# EAGLE design Schema (EAGLE 6.5.0)
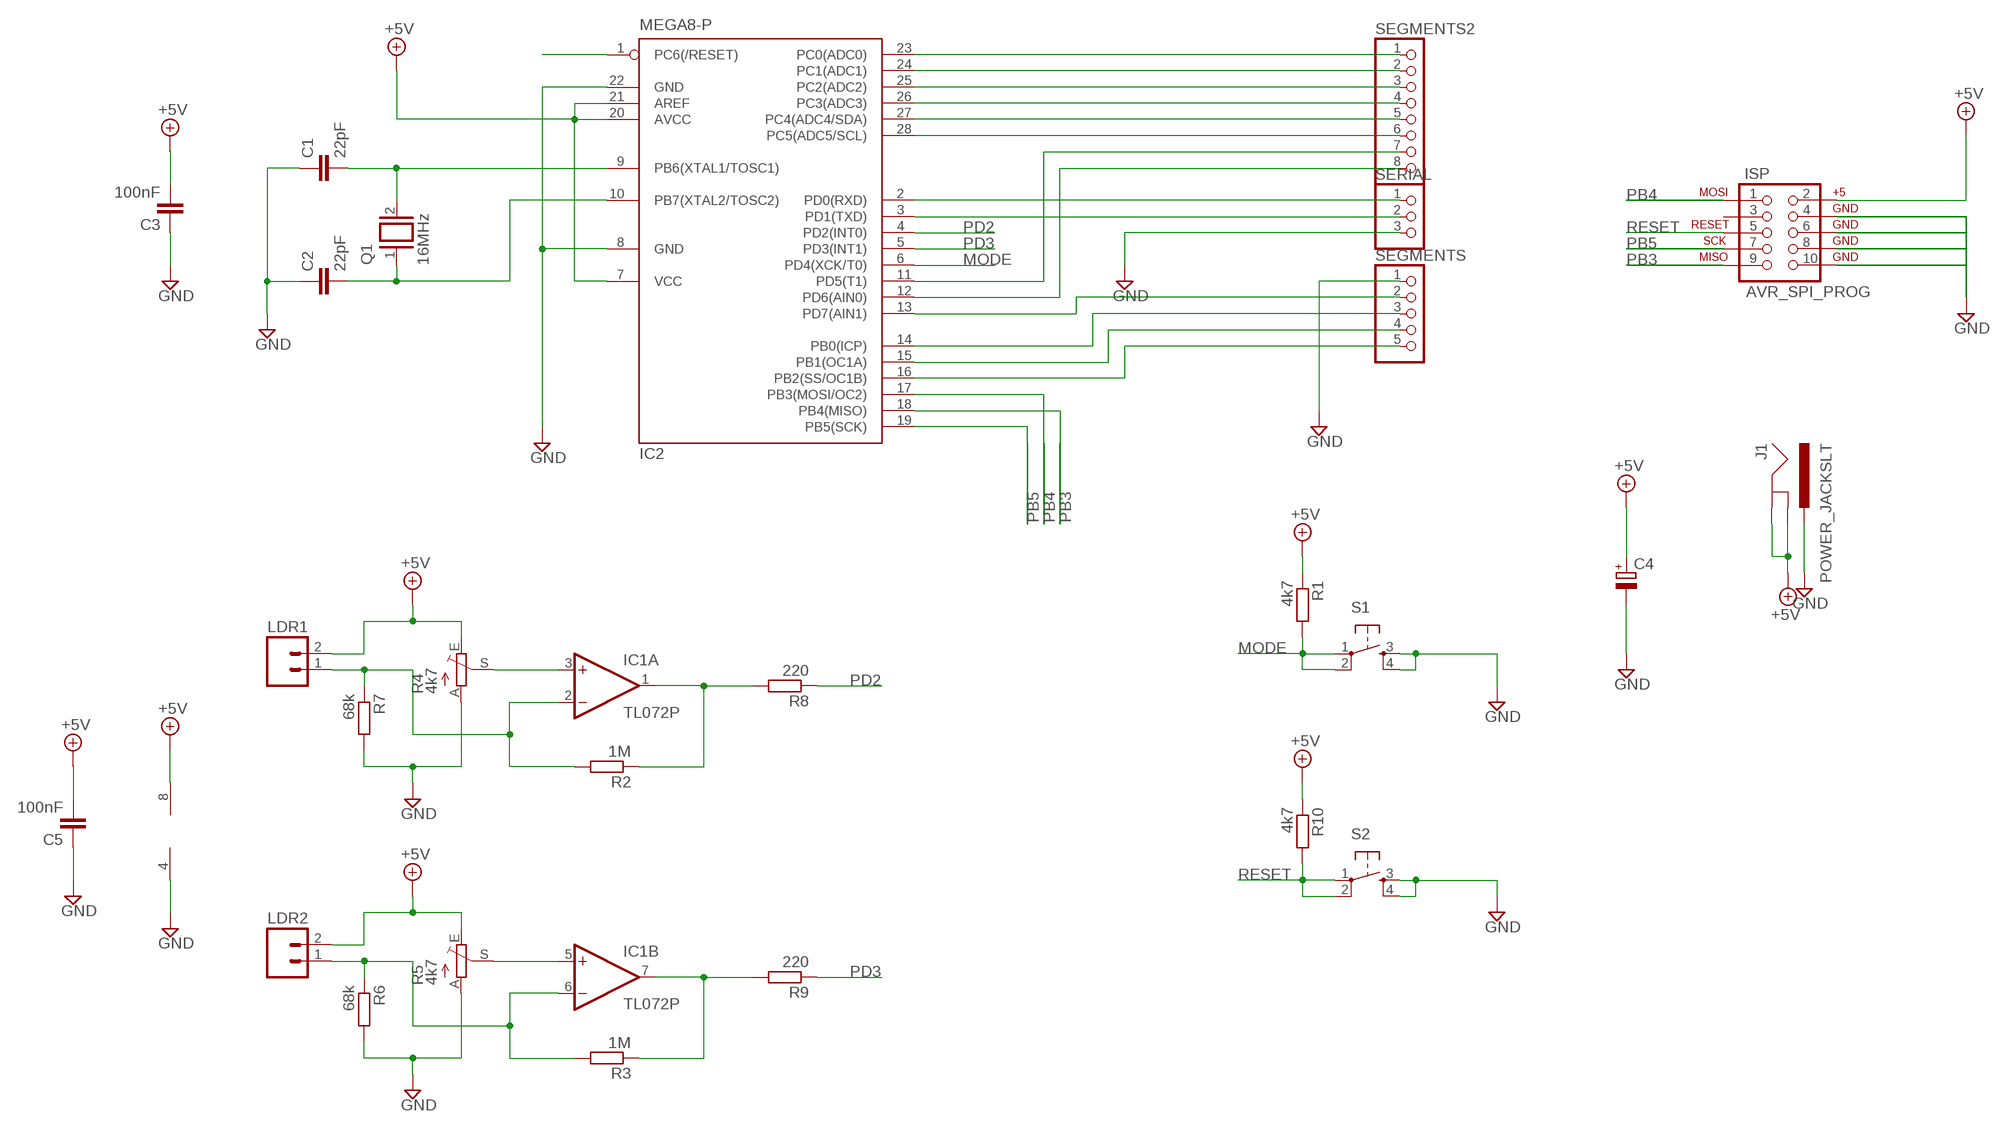
[diagram p0: schematic, sheet 1]

## Parts
C1  22pF  C-EU025-024X044  [C025-024X044]
C2  22pF  C-EU025-024X044  [C025-024X044]
C3  100nF  C-EU025-024X044  [C025-024X044]
C4  CPOL-EUTT2D5  [TT2D5]
C5  100nF  C-EU025-024X044  [C025-024X044]
IC1  TL072P  [DIL08]
IC2  MEGA8-P  [DIL28-3]
ISP  AVR_SPI_PROG  [AVR_ICSP]
J1  POWER_JACKSLT  [POWER_JACK_SLOT]
LDR1  M02LOCK  [1X02_LOCK]
LDR2  M02LOCK  [1X02_LOCK]
Q1  16MHz  XTAL/S  [QS]
R1  4k7  R-EU_0204/7  [0204/7]
R2  1M  R-EU_0204/7  [0204/7]
R3  1M  R-EU_0204/7  [0204/7]
R4  4k7  TRIM_EU-LI10  [LI10]
R5  4k7  TRIM_EU-LI10  [LI10]
R6  68k  R-EU_0204/7  [0204/7]
R7  68k  R-EU_0204/7  [0204/7]
R8  220  R-EU_0204/7  [0204/7]
R9  220  R-EU_0204/7  [0204/7]
R10  4k7  R-EU_0204/7  [0204/7]
S1  TAC_SWITCHPTH  [TACTILE-PTH]
S2  TAC_SWITCHPTH  [TACTILE-PTH]
SEGMENTS  PINHD-1X5  [1X05]
SEGMENTS2  PINHD-1X8  [1X08]
SERIAL  PINHD-1X3  [1X03]

## Nets
+5V: C3.2 C4.+ C5.2 IC1.8(P:V+) IC2.7(VCC) IC2.20(AVCC) IC2.21(AREF) ISP.2 J1.GND@1(GNDBREAK) J1.GND@2(GND) LDR1.2 LDR2.2 R1.1 R4.E R5.E R10.1
GND: C1.1 C2.1 C3.1 C4.- C5.1 IC1.4(P:V-) IC2.8(GND) IC2.22(GND) ISP.4 ISP.6 ISP.8 ISP.10 J1.PWR R4.A R5.A R6.2 R7.2 S1.3 S1.4 S2.3 S2.4 SEGMENTS.1 SERIAL.3
MODE: IC2.6(PD4(XCK/T0)) R1.2 S1.1 S1.2
N$1: C1.2 IC2.9(PB6(XTAL1/TOSC1)) Q1.2
N$2: C2.2 IC2.10(PB7(XTAL2/TOSC2)) Q1.1
N$3: IC1.1(A:OUT) R2.1 R8.2
N$4: IC2.3(PD1(TXD)) SERIAL.2
N$5: IC2.2(PD0(RXD)) SERIAL.1
N$6: IC1.7(B:OUT) R3.1 R9.2
N$7: IC1.3(A:+IN) R4.S
N$8: IC1.5(B:+IN) R5.S
N$9: IC1.6(B:-IN) LDR2.1 R3.2 R6.1
N$10: IC1.2(A:-IN) LDR1.1 R2.2 R7.1
N$11: IC2.16(PB2(SS/OC1B)) SEGMENTS.5
N$12: IC2.15(PB1(OC1A)) SEGMENTS.4
N$13: IC2.14(PB0(ICP)) SEGMENTS.3
N$15: IC2.24(PC1(ADC1)) SEGMENTS2.2
N$16: IC2.25(PC2(ADC2)) SEGMENTS2.3
N$17: IC2.26(PC3(ADC3)) SEGMENTS2.4
N$18: IC2.27(PC4(ADC4/SDA)) SEGMENTS2.5
N$19: IC2.28(PC5(ADC5/SCL)) SEGMENTS2.6
N$20: IC2.12(PD6(AIN0)) SEGMENTS2.8
N$21: IC2.11(PD5(T1)) SEGMENTS2.7
N$22: IC2.13(PD7(AIN1)) SEGMENTS.2
PB3: IC2.18(PB4(MISO)) ISP.9
PB4: IC2.17(PB3(MOSI/OC2)) ISP.1
PB5: IC2.19(PB5(SCK)) ISP.7
PD2: IC2.4(PD2(INT0)) R8.1
PD3: IC2.5(PD3(INT1)) R9.1
RESET: IC2.1(PC6(/RESET)) ISP.5 R10.2 S2.1 S2.2
SEGMENTS: IC2.23(PC0(ADC0)) SEGMENTS2.1
Unconnected: ISP.3

## Library data of the parts
C1-C3 C5 = rcl:C-EU: CAPACITOR, European symbol
C4 = rcl:CPOL-EU: POLARIZED CAPACITOR, European symbol
IC1 = linear:TL072: OP AMP
IC2 = atmel:MEGA8-P: MICROCONTROLLER 8 Kbytes FLASH, 1 kbytes SRAM, 512 bytes EEPROM, USART, 4-channel 10 bit ADC, 2-channel 8 bit ADC Pin compatible with Atmega48, ATMega88, ATMega168 Source: avr.lbr; OC_FARNELL: unknown; OC_NEWARK: unknown
ISP = SparkFun:AVR_SPI_PROG: AVR ICSP Header This is the standard AVR In Circuit Serial Programming header. Minimal, but includes pin one indicator. Works with standard Olimex programmers. Also look for the 6-pin reduced version. Spark Fun Electronics SKU: PRT-00778
J1 = SparkFun:POWER_JACK: Power Jack This is the standard 5.5mm barrel jack for power. The PTH is the most common, proven, reliable, footprint. All others are experimental. The Slot footprint only works if the mill layer is transmitted to the PCB fab house so be warned. Spark Fun Electronics SKU : PRT-00119. Mating wall wart : TOL-00298 (and others)
LDR1 LDR2 = SparkFun:M02: Header 2 Standard 2-pin 0.1" header. Use with straight break away headers (SKU : PRT-00116), right angle break away headers (PRT-00553), swiss pins (PRT-00743), machine pins (PRT-00117), and female headers (PRT-00115). Molex polarized connector foot print use with SKU : PRT-08233 with associated crimp pins and housings.
Q1 = special:XTAL/S: CRYSTAL
R1-R3 R6-R10 = rcl:R-EU_: RESISTOR, European symbol
R4 R5 = pot:TRIM_EU-: POTENTIOMETER
S1 S2 = SparkFun:TAC_SWITCH: Momentary Switch Button commonly used for reset or general input. Spark Fun Electronics SKU : COM-00097
SEGMENTS = pinhead:PINHD-1X5: PIN HEADER
SEGMENTS2 = pinhead:PINHD-1X8: PIN HEADER
SERIAL = pinhead:PINHD-1X3: PIN HEADER

## Board
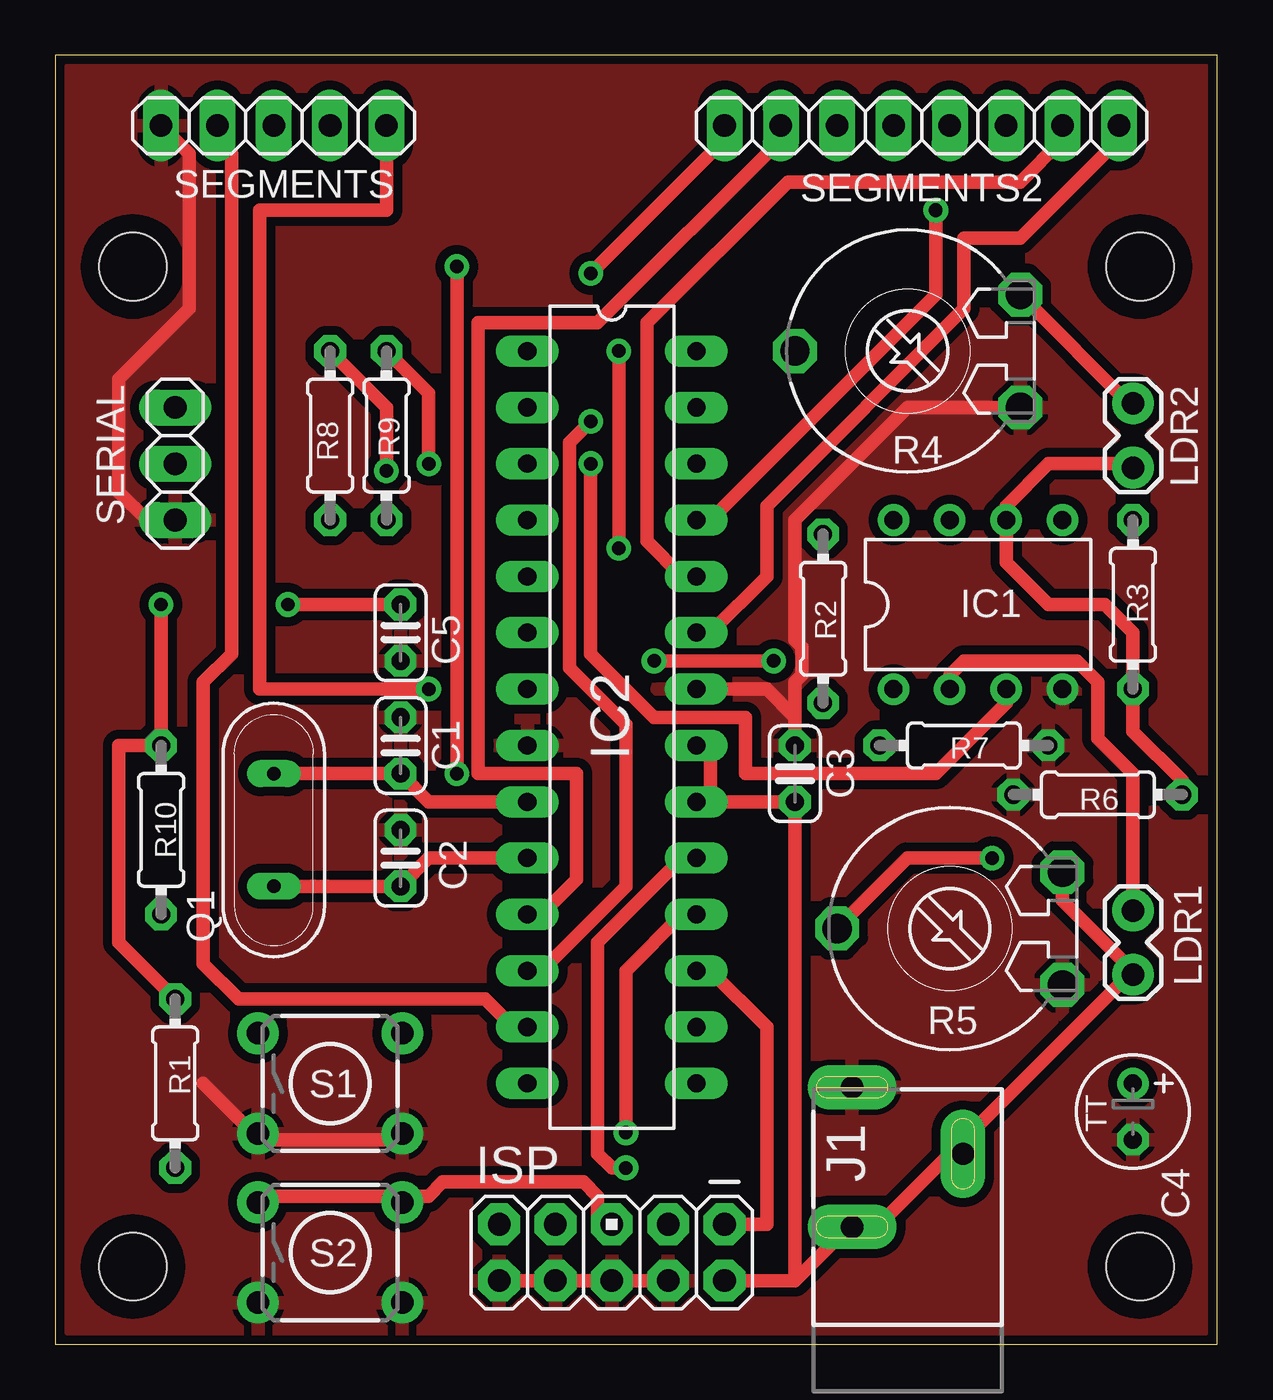
[diagram p1: board, top side]
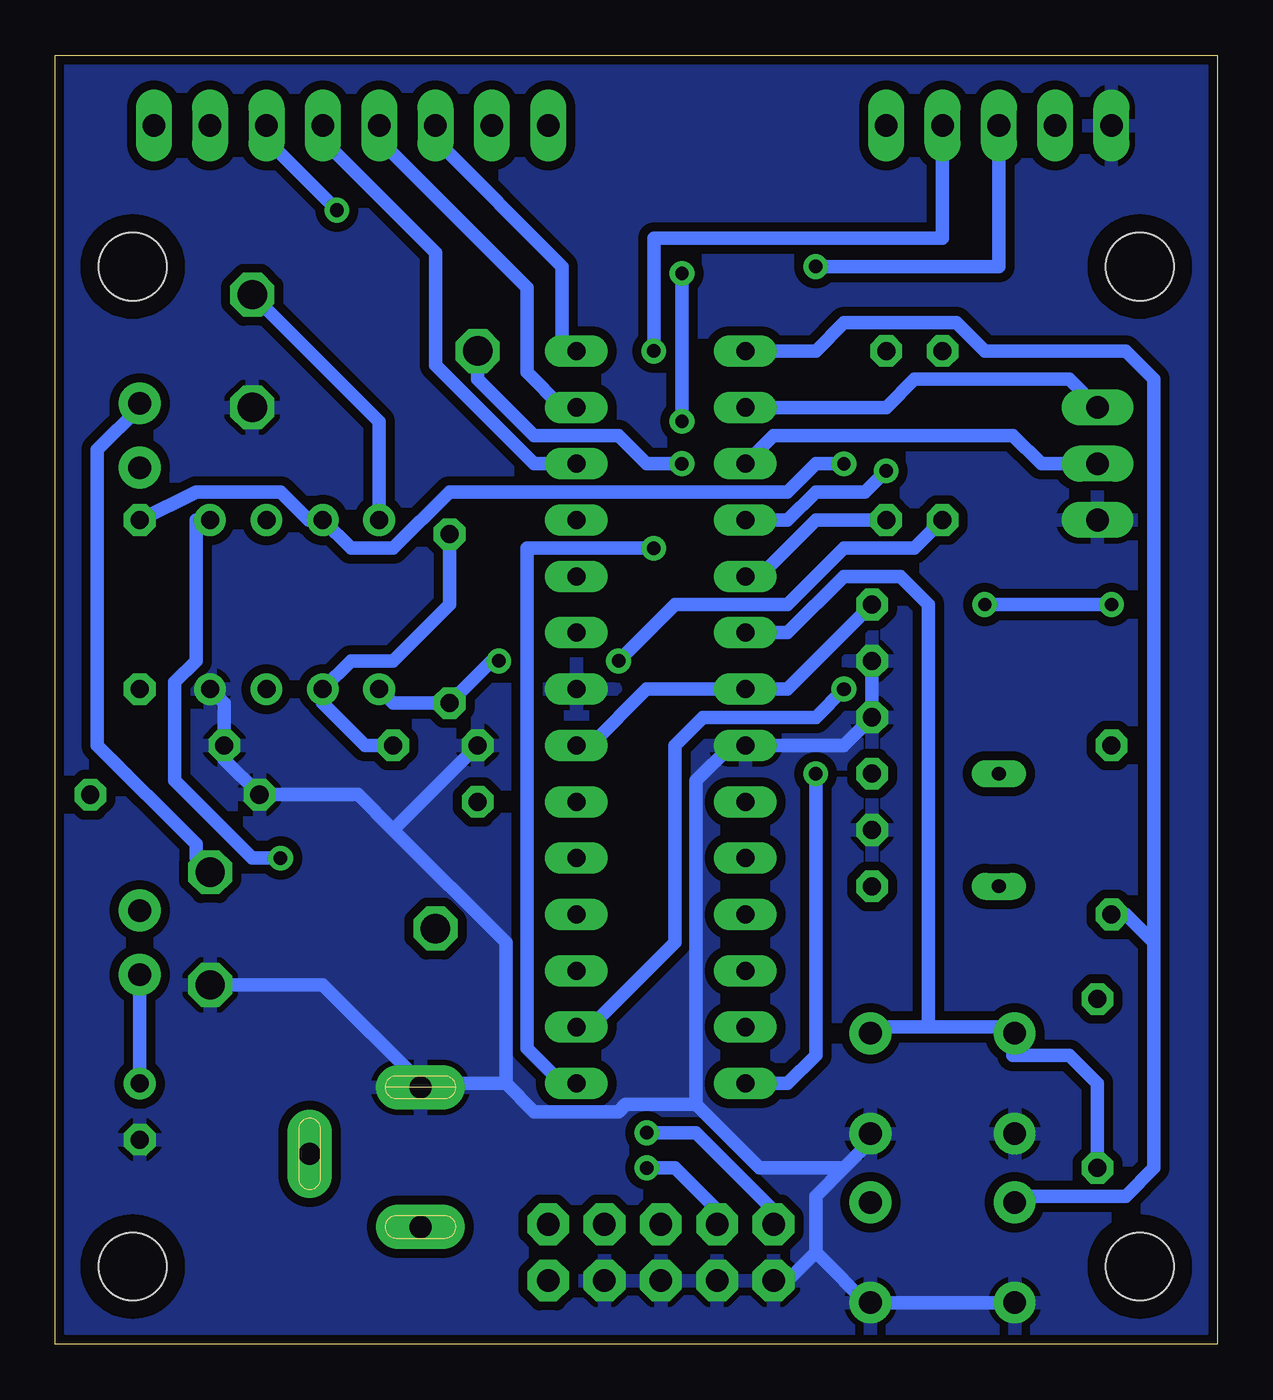
[diagram p2: board, bottom side, seen from below]

Size 52.38 x 58.09 mm. Coordinates in mm from the lower left corner, seen from the top.
Outline: 0,0 52.38,0 52.38,58.09 0,58.09 0,0
Copper layers (1*16): Top 0.035mm / dielectric 1.5mm / Bottom 0.035mm
Design rules "default": minimum track width 8mil, minimum drill 20mil, track to track 8mil, track to pad 8mil, pad to pad 8mil, via to via 8mil, smd to smd 8mil, copper to edge 10mil, drill to drill 8mil, minimum pad ring 12mil, minimum via ring 10mil, stop-mask expansion 4mil, vias tented up to drill 25mil, thermal gap 10mil

### Footprints (pad centres in the part's own frame; a part is rotated, then mirrored left to right if it is on the bottom)
C025-024X044 = drill 0.813 octagon: 1 -1.27,0; 2 1.27,0
TT2D5 = drill 0.813: + -1.27,0 | drill 0.813 octagon: - 1.27,0
DIL08 = drill 0.813 pad 1.27: 1 -3.81,-3.81; 2 -1.27,-3.81; 3 1.27,-3.81; 4 3.81,-3.81; 5 3.81,3.81; 6 1.27,3.81; 7 -1.27,3.81; 8 -3.81,3.81
DIL28-3 = drill 0.813 long: 1 -16.51,-3.81; 2 -13.97,-3.81; 3 -11.43,-3.81; 4 -8.89,-3.81; 5 -6.35,-3.81; 6 -3.81,-3.81; 7 -1.27,-3.81; 8 1.27,-3.81; 9 3.81,-3.81; 10 6.35,-3.81; 11 8.89,-3.81; 12 11.43,-3.81; 13 13.97,-3.81; 14 16.51,-3.81; 15 16.51,3.81; 16 13.97,3.81; 17 11.43,3.81; 18 8.89,3.81; 19 6.35,3.81; 20 3.81,3.81; 21 1.27,3.81; 22 -1.27,3.81; 23 -3.81,3.81; 24 -6.35,3.81; 25 -8.89,3.81; 26 -11.43,3.81; 27 -13.97,3.81; 28 -16.51,3.81
AVR_ICSP = drill 1.016 pad 1.88 octagon: 1 -1.27,5.08; 2 1.27,5.08; 3 -1.27,2.54; 4 1.27,2.54; 5 -1.27,0; 6 1.27,0; 7 -1.27,-2.54; 8 1.27,-2.54; 9 -1.27,-5.08; 10 1.27,-5.08
POWER_JACK_SLOT = drill 1 pad 2 long: GND@1 2.58,7.5; GND@2 7.58,10.8; PWR 2.58,13.8
1X02_LOCK = drill 1.016 pad 1.88: 1 -0.178,0; 2 2.718,0
QS = drill 0.61 long: 1 -2.54,0; 2 2.54,0
0204/7 = drill 0.813 octagon: 1 -3.81,0; 2 3.81,0
LI10 = drill 1.321 octagon: A -2.54,-5.08; E 2.54,-5.08; S 0,5.08
TACTILE-PTH = drill 1.016 pad 1.88: 1 -3.251,2.261; 2 3.251,2.261; 3 -3.251,-2.261; 4 3.251,-2.261
1X05 = drill 1.016 long: 1 -5.08,0; 2 -2.54,0; 3 0,0; 4 2.54,0; 5 5.08,0
1X08 = drill 1.016 long: 1 -8.89,0; 2 -6.35,0; 3 -3.81,0; 4 -1.27,0; 5 1.27,0; 6 3.81,0; 7 6.35,0; 8 8.89,0
1X03 = drill 1.016 long: 1 -2.54,0; 2 0,0; 3 2.54,0
STAND-OFF-TIGHT = hole 3.048: 0,0

### Placement (x,y rotation side)
C1  15.56,26.99 270 top
C2  15.56,21.91 270 top
C3  33.34,25.72 270 top
C4  48.58,10.48 270 top
C5  15.56,32.07 90 top
IC1  41.59,33.34 0 top
IC2  25.08,28.26 270 top
ISP  25.08,4.13 270 top
J1  33.34,-2.22 0 top
LDR1  48.58,19.37 270 top
LDR2  48.58,39.69 90 top
Q1  9.84,23.18 90 top
R1  5.4,11.75 270 top
R2  34.61,32.7 90 top
R3  48.58,33.34 270 top
R4  38.42,44.77 90 top
R5  40.32,18.73 90 top
R6  46.99,24.77 180 top
R7  40.96,26.99 0 top
R8  12.38,40.96 270 top
R9  14.92,40.96 90 top
R10  4.76,23.18 270 top
S1  12.38,11.75 0 top
S2  12.38,4.13 0 top
SEGMENTS  9.84,54.93 0 top
SEGMENTS2  39.05,54.93 180 top
SERIAL  5.4,39.69 270 top
U$2  [STAND-OFF-TIGHT]  3.49,3.49 0 top
U$3  [STAND-OFF-TIGHT]  3.49,48.58 0 top
U$4  [STAND-OFF-TIGHT]  48.89,48.58 0 top
U$5  [STAND-OFF-TIGHT]  48.89,3.49 0 top

### Tracks (layer width: path | path; a pad name or v marks a point on that pad's centre or on a via)
+5V  (via drill 0.6)
  Top 0.61: R4.E 48.58,42.23 LDR2.2 | 48.58,16.83 45.4,20 R5.E | 48.58,16.83 40.96,9.21 | 48.58,16.83 LDR1.2 | R1.1 2.86,18.1 2.86,26.99 4.13,26.99 | 29.53,24.45 29.53,26.99 IC2.21 | 29.53,24.45 C3.2 33.34,2.86 | 29.53,24.45 IC2.20 | 33.34,2.86 ISP.2 | 33.34,2.86 35.88,5.4 J1.GND@1 37.15,5.4 40.96,9.21 | 40.96,9.21 J1.GND@2 | R10.1 4.13,26.99 | C5.2 v10.48,33.34 | v4.76,33.34 4.76,27.62 4.13,26.99
  Bottom 0.61: IC1.8 37.78,41.59 R4.E | LDR2.2 48.58,42.23 50.48,40.32 50.48,26.99 46.04,22.54 46.04,21.91 R5.E | C5.2 19.37,29.53 IC2.7 25.72,29.53 28.26,26.99 IC2.21 | C4.+ LDR1.2 | v10.48,33.34 v4.76,33.34
GND
  Top 0.61: IC2.22 32.07,29.53 33.34,28.26 | C3.1 33.34,28.26 | R4.A 38.42,42.23 33.34,37.15 33.34,31.75 33.66,31.43 33.66,30.16 33.34,29.84 33.34,28.26 | SEGMENTS.1 6.03,53.66 6.03,46.67 2.86,43.5 2.86,38.42 4.13,37.15 SERIAL.3 | 9.21,9.21 15.56,9.21 S1.4 | ISP.10 ISP.8 ISP.6 ISP.4 | 9.21,9.21 6.67,11.75 | 9.21,9.21 S1.3
  Bottom 0.61: 37.15,11.75 J1.PWR | 16.83,7.94 18.1,6.67 18.1,4.13 | 16.83,7.94 15.56,9.21 S1.4 | 18.1,4.13 19.37,2.86 ISP.10 | 23.49,10.79 23.49,25.4 21.91,26.99 IC2.8 16.83,26.99 C1.1 C5.1 | 23.49,10.79 20.64,7.94 16.83,7.94 | 32.07,11.75 32.07,18.1 37.15,23.18 | 32.07,11.75 30.8,10.48 26.99,10.48 26.67,10.79 23.49,10.79 | S2.3 15.28,1.87 15.56,1.59 18.1,4.13 | 37.15,23.18 38.74,24.77 R6.2 44.77,26.35 R7.2 44.77,28.89 IC1.4 | R5.A 40.32,16.19 35.88,11.75 32.07,11.75 | C3.1 37.15,23.18
  pour Top (isolate 0.406): 0.63,57.47 0.63,0.64 51.75,0.64 51.75,57.47
  pour Bottom (isolate 0.406): 0.63,0.64 51.75,0.64 51.75,57.47 0.63,57.47
MODE
  Bottom 0.61: R1.2 5.4,11.75 6.67,13.02 9.21,13.02 9.21,14.29 | IC2.6 19.37,32.07 16.83,34.61 14.29,34.61 13.02,33.34 13.02,14.29 | 15.56,14.29 S1.2 15.35,14.29 13.02,14.29 | 9.21,14.29 S1.1 | 9.21,14.29 13.02,14.29
N$1
  Top 0.61: Q1.2 C1.2 16.83,24.45 IC2.9
N$2
  Top 0.61: Q1.1 C2.2 16.83,21.91 IC2.10
N$3  (via drill 0.61)
  Top 0.61: v32.38,30.8 v26.99,30.8
  Bottom 0.61: v26.99,30.8 24.45,33.34 19.37,33.34 16.83,35.88 13.65,35.88 R8.2 | v32.38,30.8 32.7,30.8 R2.1 37.15,28.89 IC1.1
N$4
  Bottom 0.61: 4.13,39.69 SERIAL.2 7.94,39.69 9.21,40.96 20,40.96 IC2.3 21.91,39.69
N$5
  Bottom 0.61: SERIAL.1 6.67,43.5 13.65,43.5 14.92,42.23 IC2.2
N$6  (via drill 0.6)
  Top 0.61: v16.83,39.69 16.83,42.86 R9.2
  Bottom 0.61: R3.1 46.04,38.42 42.23,38.42 40.96,37.15 IC1.7 39.05,35.88 37.15,35.88 34.61,38.42 19.37,38.42 18.1,39.69 v16.83,39.69
N$7  (via drill 0.61)
  Top 0.61: v24.13,39.69 24.13,31.11 26.99,28.26 31.11,28.26 31.11,25.72 39.69,25.72 42.86,28.89 IC1.3
  Bottom 0.61: v24.13,39.69 25.72,39.69 26.99,40.96 30.8,40.96 33.34,43.5 R4.S
N$8  (via drill 0.61)
  Top 0.61: v42.23,21.91 38.42,21.91 R5.S
  Bottom 0.61: IC1.5 46.04,37.15 46.04,30.8 46.99,29.84 46.99,25.4 43.5,21.91 v42.23,21.91
N$9
  Top 0.61: LDR2.1 48.58,39.69 44.77,39.69 42.86,37.78 IC1.6 42.86,35.24 44.77,33.34 47.31,33.34 48.58,32.07 R3.2 48.58,27.62 50.8,25.4 R6.1
N$10
  Top 0.61: 48.58,19.37 LDR1.1 48.58,25.72 46.99,27.31 46.99,29.84 46.04,30.8 40.96,30.8 40.32,30.16 IC1.2
  Bottom 0.61: R2.2 34.61,33.34 37.15,30.8 39.05,30.8 IC1.2 40.32,28.89 38.42,26.99 R7.1
N$11  (via drill 0.61)
  Top 0.61: SEGMENTS.5 14.92,51.12 9.21,51.12 9.21,29.53 v16.83,29.53
  Bottom 0.61: v16.83,29.53 18.1,28.26 23.18,28.26 24.45,26.99 24.45,18.1 28.26,14.29 IC2.16
N$12  (via drill 0.61)
  Top 0.61: v25.4,44.77 v25.4,35.88
  Bottom 0.61: v25.4,35.88 31.11,35.88 31.11,13.34 29.53,11.75 IC2.15 | v25.4,44.77 25.4,49.85 12.38,49.85 SEGMENTS.4
N$13  (via drill 0.6, 0.61)
  Top 0.61: v18.1,48.58 v18.1,25.72
  Bottom 0.61: SEGMENTS.3 9.84,48.58 v18.1,48.58 | 20.64,11.75 IC2.14 19.37,11.75 18.1,13.02 v18.1,25.72
N$15
  Top 0.61: IC2.24 28.26,34.61 26.67,36.19 26.67,46.04 33.02,52.39 43.5,52.39 45.4,54.29 SEGMENTS2.2
N$16  (via drill 0.61)
  Top 0.61: v39.69,51.12 39.69,47.31 29.53,37.15 IC2.25
  Bottom 0.61: SEGMENTS2.3 42.86,54.29 v39.69,51.12
N$17
  Bottom 0.61: IC2.26 30.8,39.69 35.24,44.13 35.24,49.21 40.32,54.29 SEGMENTS2.4
N$18
  Bottom 0.61: SEGMENTS2.5 37.78,54.29 31.11,47.62 31.11,43.82 29.53,42.23 IC2.27
N$19
  Bottom 0.61: SEGMENTS2.6 35.24,54.29 29.53,48.58 29.53,44.77 IC2.28
N$20  (via drill 0.6)
  Top 0.61: v24.13,48.26 30.16,54.29 SEGMENTS2.8 | IC2.12 21.91,16.83 25.72,20.64 25.72,27.94 23.18,30.48 23.18,40.64 v24.13,41.59
  Bottom 0.61: v24.13,41.59 v24.13,48.26
N$21
  Top 0.61: SEGMENTS2.7 32.7,54.29 24.45,46.04 19.05,46.04 19.05,25.72 23.49,25.72 23.49,20.95 21.91,19.37 IC2.11
N$22
  Top 0.61: SEGMENTS.2 7.3,54.29 7.94,53.66 7.94,31.11 6.67,29.84 6.67,17.15 8.26,15.56 19.37,15.56 20.64,14.29 IC2.13 21.91,14.29
PB3  (via drill 0.61)
  Top 0.61: v25.72,9.52 25.72,16.83 28.26,19.37 IC2.18
  Bottom 0.61: v25.72,9.52 23.49,9.52 19.37,5.4 ISP.9
PB4
  Top 0.61: IC2.17 29.53,16.83 32.07,14.29 32.07,5.4 ISP.1
PB5  (via drill 0.61)
  Top 0.61: IC2.19 28.26,21.91 24.45,18.1 24.45,8.57 25.08,7.94 v25.72,7.94
  Bottom 0.61: v25.72,7.94 24.45,7.94 21.91,5.4 ISP.7
PD2  (via drill 0.6)
  Top 0.61: v14.92,39.37 14.92,42.23 R8.1
  Bottom 0.61: IC2.4 19.37,37.15 18.1,38.42 15.87,38.42 v14.92,39.37
PD3
  Bottom 0.61: IC2.5 20.64,34.61 18.1,37.15 R9.1
RESET
  Top 0.61: 15.56,6.67 9.21,6.67 S2.1 | 15.56,6.67 16.83,6.67 17.46,7.3 23.81,7.3 24.45,6.67 24.45,5.4 ISP.5 | 15.56,6.67 S2.2
  Bottom 0.61: S2.1 9.21,6.67 4.13,6.67 2.86,7.94 2.86,18.1 | R10.2 4.13,19.37 2.86,18.1 | 2.86,18.1 2.86,43.5 4.13,44.77 10.48,44.77 11.75,46.04 16.83,46.04 18.1,44.77 IC2.1
SEGMENTS
  Top 0.61: IC2.23 29.53,32.07 32.07,34.61 32.07,37.78 40.96,46.67 40.96,49.85 43.5,49.85 47.94,54.29 SEGMENTS2.1

### Text on the board
tDocu: BasilFX | 2012 | MEER BIER